# EasyEDA schematic EasyEDA export.json
TITLE: Don't wake my wife; REV: 0.1; Date: 2021-07-02; Sheet: 1/1; Drawn By: Jan Šimonek; Company: Jan Šimonek
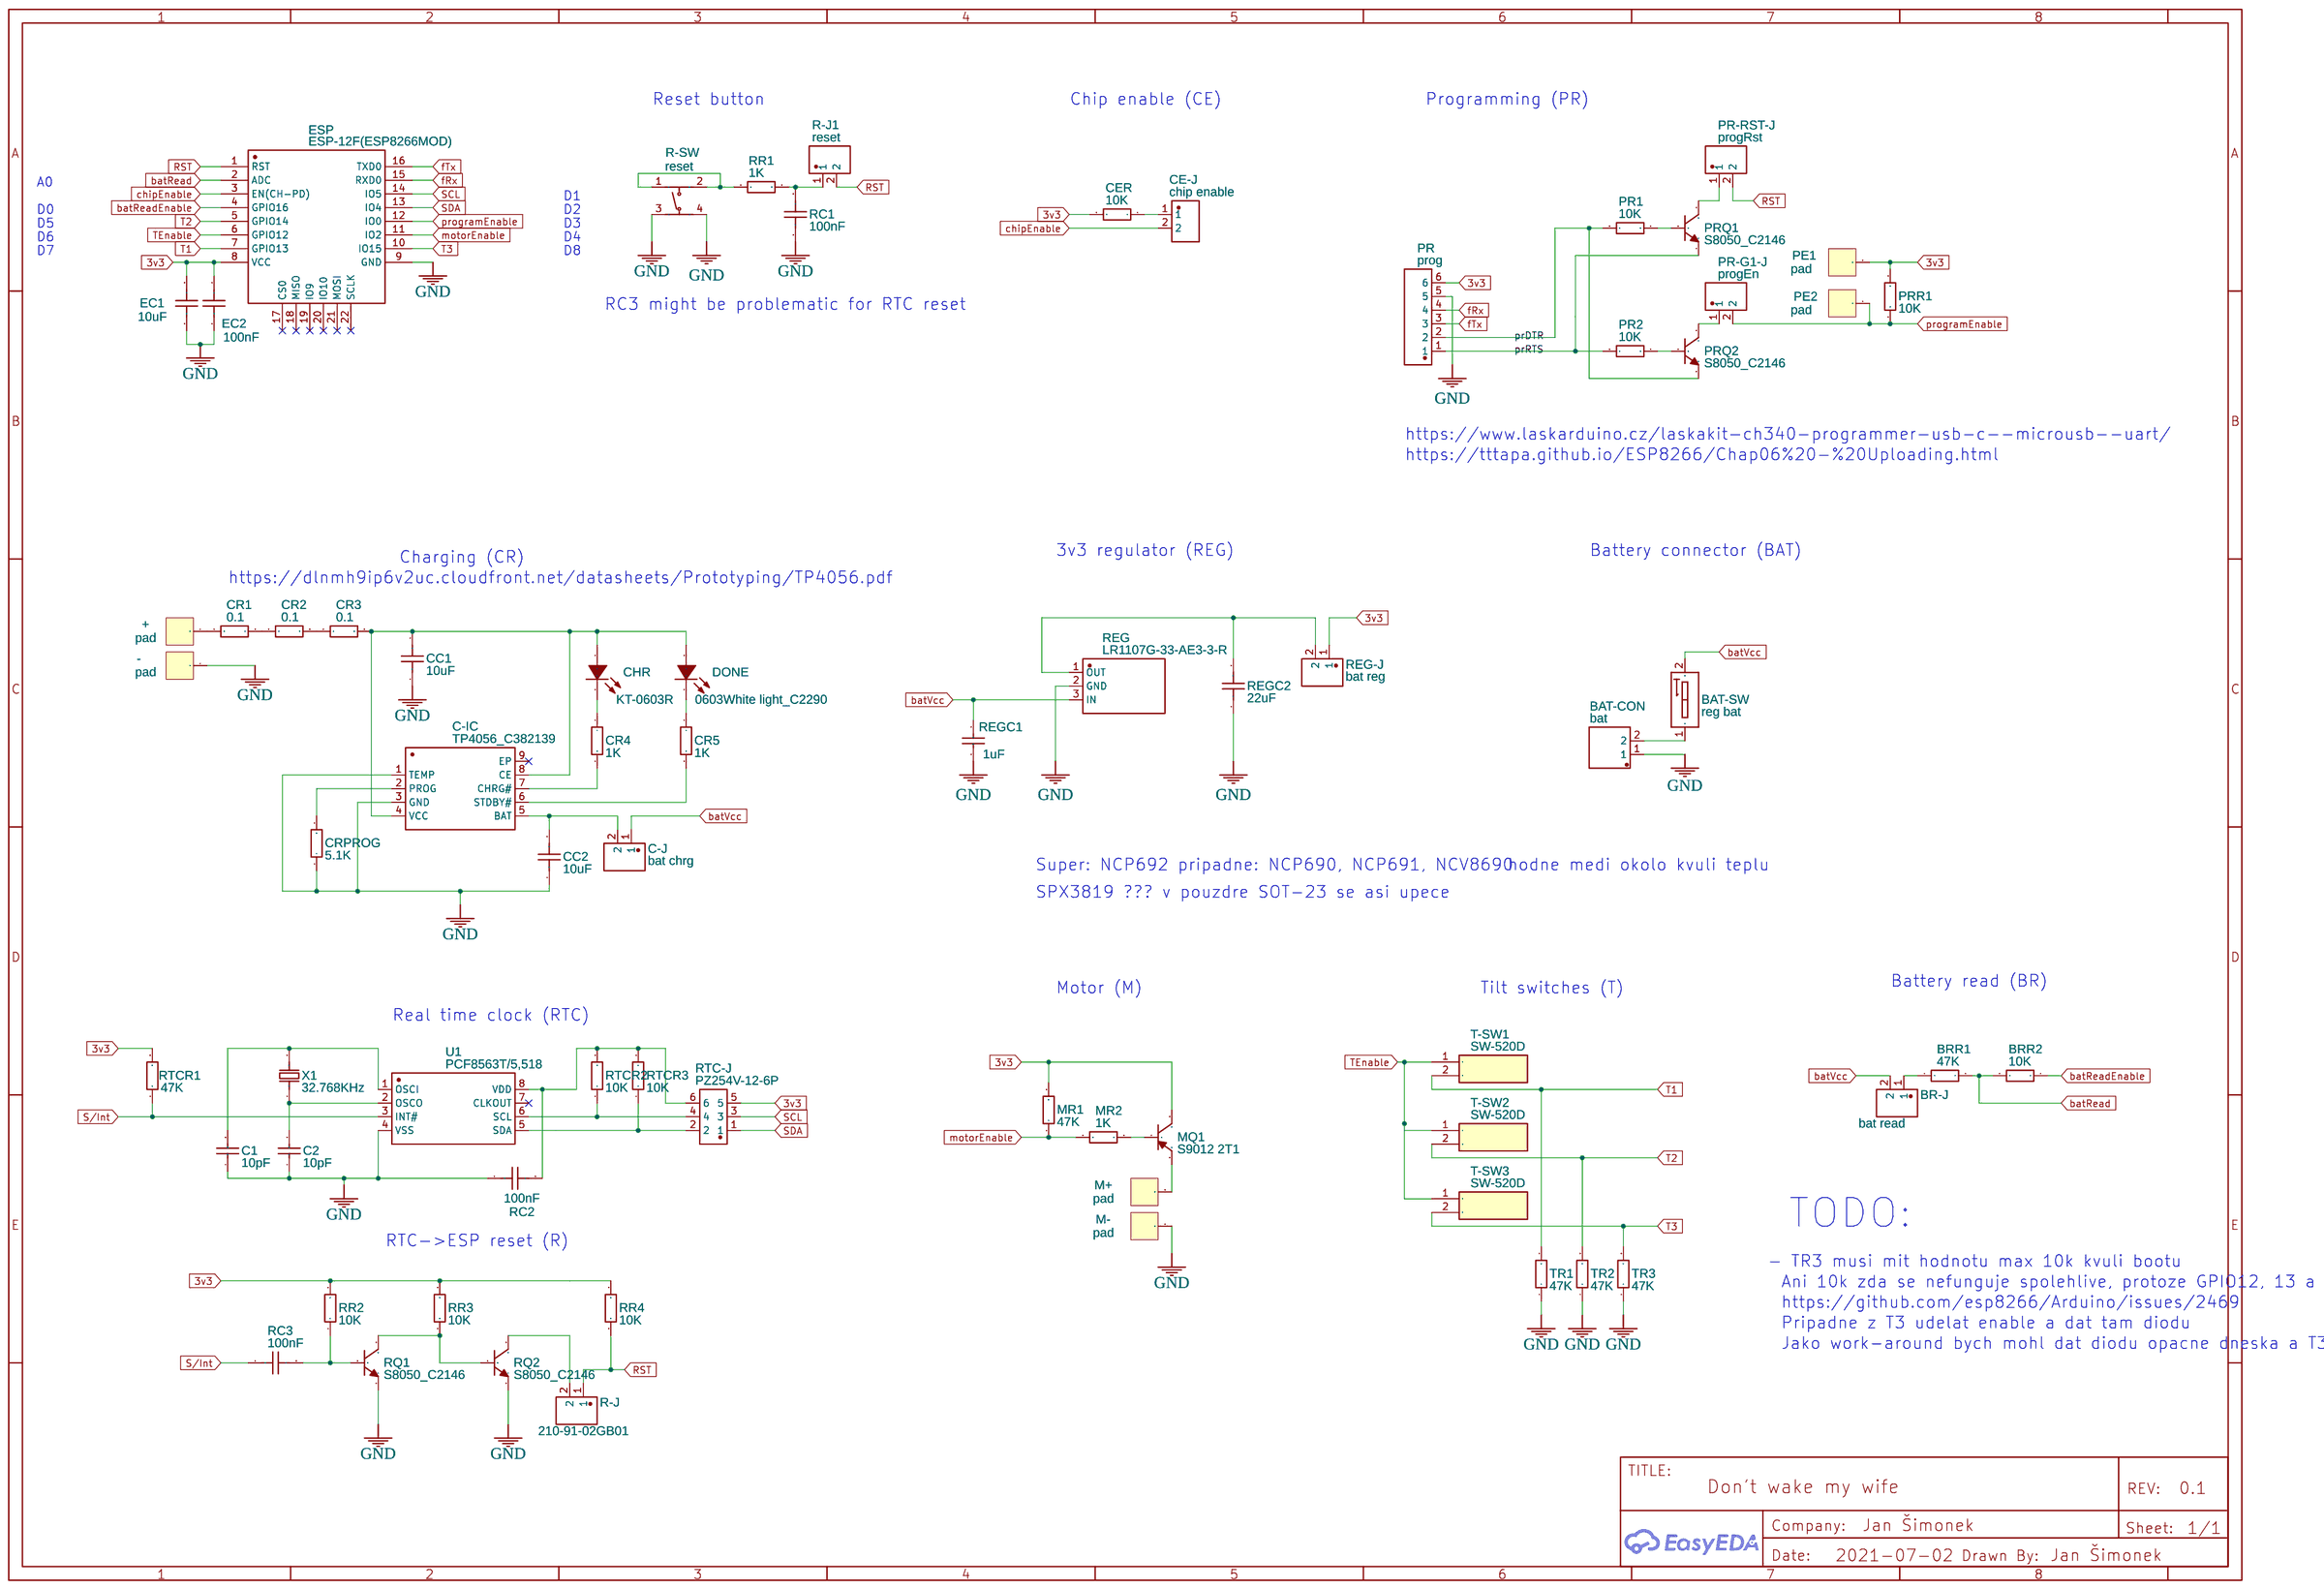
[diagram p0: schematic sheet]

## Parts
+  pad  [2.2MM PAD]
-  pad  [2.2MM PAD]
BAT-CON  bat  [CONN-TH_S2B-XH-A-LF-SN]
BAT-SW  reg bat  [SW-SMD_DSIC01LSGET]
BR-J  bat read  [HDR-TH_2P-P2.54-V-M-1]
BRR1  47K  [R0603]
BRR2  10K  [R0603]
C1  10pF  [C0603]
C2  10pF  [C0603]
C-IC  TP4056_C382139  [ESOP-8_L4.9-W3.9-P1.27-LS6.0-BL-EP]
C-J  bat chrg  [HDR-TH_2P-P2.54-V-M-1]
CC1  10uF  [C0603]
CC2  10uF  [C0603]
CE-J  chip enable  [HDR-TH_2P-P2.54-V-M-1]
CER  10K  [R0603]
CHR  KT-0603R  [LED0603-R-RD]
CR1  0.1  [R0603]
CR2  0.1  [R0603]
CR3  0.1  [R0603]
CR4  1K  [R0603]
CR5  1K  [R0603]
CRPROG  5.1K  [R0603]
DONE  0603White light_C2290  [LED0603-R-RD]
EC1  10uF  [C0603]
EC2  100nF  [C0603]
ESP  ESP-12F(ESP8266MOD)  [WIFIM-SMD_ESP-12F-ESP8266MOD]
M+  pad  [2.2MM PAD]
M-  pad  [2.2MM PAD]
MQ1  S9012 2T1  [SOT-23-3_L2.9-W1.3-P1.90-LS2.4-BR]
MR1  47K  [R0603]
MR2  1K  [R0603]
PE1  pad  [2.2MM PAD]
PE2  pad  [2.2MM PAD]
PR  prog  [HDR-TH_6P-P2.54-V-F]
PR1  10K  [R0603]
PR2  10K  [R0603]
PR-G1-J  progEn  [HDR-TH_2P-P2.54-V-M-1]
PR-RST-J  progRst  [HDR-TH_2P-P2.54-V-M-1]
PRQ1  S8050_C2146  [SOT-23-3_L3.0-W1.7-P0.95-LS2.9-BR]
PRQ2  S8050_C2146  [SOT-23-3_L3.0-W1.7-P0.95-LS2.9-BR]
PRR1  10K  [R0603]
R-J  210-91-02GB01  [HDR-TH_2P-P2.54-V-M-1]
R-J1  reset  [HDR-TH_2P-P2.54-V-M-1]
R-SW  reset  [SW-SMD_4P-L4.5-W4.5-P3.00-LS7.0]
RC1  100nF  [C0603]
RC2  100nF  [C0603]
RC3  100nF  [C0603]
REG  LR1107G-33-AE3-3-R  [SOT-23-3_L3.0-W1.7-P0.95-LS2.9-BR]
REG-J  bat reg  [HDR-TH_2P-P2.54-V-M-1]
REGC1  1uF  [C0603]
REGC2  22uF  [C0603]
RQ1  S8050_C2146  [SOT-23-3_L3.0-W1.7-P0.95-LS2.9-BR]
RQ2  S8050_C2146  [SOT-23-3_L3.0-W1.7-P0.95-LS2.9-BR]
RR1  1K  [R0603]
RR2  10K  [R0603]
RR3  10K  [R0603]
RR4  10K  [R0603]
RTC-J  PZ254V-12-6P  [HDR-TH_6P-P2.54-V-M-R2-C3-S2.54]
RTCR1  47K  [R0603]
RTCR2  10K  [R0603]
RTCR3  10K  [R0603]
T-SW1  SW-520D  [SW520D_VER]
T-SW2  SW-520D  [SW520D_VER]
T-SW3  SW-520D  [SW520D_VER]
TR1  47K  [R0603]
TR2  47K  [R0603]
TR3  47K  [R0603]
U1  PCF8563T/5,518  [SOIC-8_L5.0-W4.0-P1.27-LS6.0-BL]
X1  32.768KHz  [FC-135R_L3.2-W1.5]

## Library data of the parts
+ - M+ M- PE1 PE2 = pad: Contributor: manailadorin
BAT-CON = S2B-XH-A-(LF)(SN): Supplier: LCSC; Supplier Part: C157931; Manufacturer: JST Sales America; Contributor: LCSC; JLCPCB Part Class: Extended Part
BAT-SW = DSIC01LSGET: Supplier: LCSC; Manufacturer: KE; Supplier Part: C54948; JLCPCB Part Class: Extended Part
BR-J C-J CE-J PR-G1-J PR-RST-J R-J R-J1 REG-J = 210-91-02GB01: Supplier: LCSC; Supplier Part: C390678; Manufacturer: PINREX; Contributor: LCSC; JLCPCB Part Class: Extended Part
BRR1 MR1 RTCR1 TR1-TR3 = 0603WAF4702T5E: Supplier: LCSC; Manufacturer: UniOhm; Supplier Part: C25819; JLCPCB Part Class: Basic Part
BRR2 CER PR1 PR2 PRR1 RR2-RR4 RTCR2 RTCR3 = 0603WAF1002T5E: Supplier: LCSC; Manufacturer: UniOhm; Supplier Part: C25804; JLCPCB Part Class: Basic Part
C1 C2 = CL10C100JB8NNNC: Supplier: LCSC; Manufacturer: SAMSUNG; Supplier Part: C1634; JLCPCB Part Class: Basic Part
C-IC = TP4056_C382139: Supplier: LCSC; Supplier Part: C382139; Manufacturer: TPOWER; Manufacturer Part: TP4056; Contributor: LCSC; JLCPCB Part Class: Extended Part
CC1 CC2 EC1 = CL10A106KP8NNNC: Supplier: LCSC; Manufacturer: SAMSUNG; Supplier Part: C19702; JLCPCB Part Class: Basic Part
CHR = KT-0603R: Supplier: LCSC; Manufacturer: KENTO; Supplier Part: C2286; JLCPCB Part Class: Basic Part
CR1-CR3 = 0603WAJ010KT5E: Supplier: LCSC; Supplier Part: C247025; Manufacturer: Uniroyal Elec; Contributor: LCSC; JLCPCB Part Class: Extended Part
CR4 CR5 MR2 RR1 = 0603WAF1001T5E: Supplier: LCSC; Manufacturer: UniOhm; Supplier Part: C21190; JLCPCB Part Class: Basic Part
CRPROG = 0603WAF5101T5E: Supplier: LCSC; Manufacturer: UniOhm; Supplier Part: C23186; JLCPCB Part Class: Basic Part
DONE = 0603White light_C2290: Supplier: LCSC; Manufacturer: KENTO; Manufacturer Part: 0603White light; Supplier Part: C2290; JLCPCB Part Class: Basic Part
EC2 RC1-RC3 = CC0603KRX7R9BB104: Supplier: LCSC; Manufacturer: YAGEO; Supplier Part: C14663; JLCPCB Part Class: Basic Part
ESP = ESP-12F(ESP8266MOD): Supplier: LCSC; Manufacturer: Ai-Thinker; Supplier Part: C82891; JLCPCB Part Class: Extended Part
MQ1 = S9012 2T1: Supplier: LCSC; Manufacturer: CJ; Supplier Part: C8543; JLCPCB Part Class: Basic Part
PR = Header-Female-2.54_1x6: Supplier: LCSC; Manufacturer: BOOMELE; Manufacturer Part: Female header 1*6p; Supplier Part: C40877; JLCPCB Part Class: Extended Part
PRQ1 PRQ2 RQ1 RQ2 = S8050_C2146: Supplier: LCSC; Manufacturer: CJ; Manufacturer Part: S8050; Supplier Part: C2146; JLCPCB Part Class: Basic Part
R-SW = UK-B0206-G5-160-JZ: Supplier: LCSC; Supplier Part: C620330; Manufacturer: USAKRO; Contributor: LCSC
REG = LR1107G-33-AE3-3-R: Supplier: LCSC; Manufacturer: UTC; Contributor: LCSC; Supplier Part: C171497; JLCPCB Part Class: Extended Part
REGC1 = CL10A105KB8NNNC: Supplier: LCSC; Manufacturer: SAMSUNG; Supplier Part: C15849; JLCPCB Part Class: Basic Part
REGC2 = CL10A226MQ8NRNC: Supplier: LCSC; Manufacturer: SAMSUNG; Supplier Part: C59461; JLCPCB Part Class: Basic Part
RTC-J = PZ254V-12-6P: Supplier: LCSC; Supplier Part: C492420; Manufacturer: XFCN; Contributor: LCSC; JLCPCB Part Class: Extended Part
T-SW1-T-SW3 = SW-520D: Contributor: adrirobot
U1 = PCF8563T/5,518: Supplier: LCSC; Manufacturer: NXP; Supplier Part: C7440; JLCPCB Part Class: Basic Part
X1 = Q13FC1350000400: Supplier: LCSC; Manufacturer: EPSON; Supplier Part: C32346; JLCPCB Part Class: Basic Part

## Nets
3v3: CER.2 EC1.2 EC2.2 ESP.8(VCC) MQ1.3(C) MR1.2 PE1.1 PR.6 PRR1.2 REG-J.1 RR2.2 RR3.2 RR4.2 RTC-J.5 RTCR1.2
GND: -.1 BAT-CON.1 C1.1 C2.1 C-IC.1(TEMP) C-IC.3(GND) CC1.1 CC2.1 CRPROG.1 EC1.1 EC2.1 ESP.9(GND) M-.1 PR.5 R-SW.3 R-SW.4 RC1.1 RC2.1 REG.2(GND) REGC1.1 REGC2.1 RQ1.2(E) RQ2.2(E) TR1.1 TR2.1 TR3.1 U1.4(VSS)
batRead: BRR1.2 BRR2.2 ESP.2(ADC)
batReadEnable: BRR2.1 ESP.4(GPIO16)
batVcc: BAT-SW.2(A2) BR-J.2 C-J.1 REG.3(IN) REGC1.2
chipEnable: CE-J.2 ESP.3(EN(CH-PD))
fRx: ESP.15(RXD0) PR.4
fTx: ESP.16(TXD0) PR.3
motorEnable: ESP.11(IO2) MR1.1 MR2.1
prDTR: PR.2 PR1.2 PRQ2.2(E)
programEnable: ESP.12(IO0) PE2.1 PR-G1-J.2 PRR1.1
prRTS: PR.1 PR2.2 PRQ1.2(E)
RST: ESP.1(RST) PR-RST-J.2 R-J.1 R-J1.2 RR4.1
S/Int: RC3.1 RTCR1.1 U1.3(INT#)
SCL: ESP.14(IO5) RTC-J.3
SDA: ESP.13(IO4) RTC-J.1
T1: ESP.7(GPIO13) T-SW1.2 TR1.2
T2: ESP.5(GPIO14) T-SW2.2 TR2.2
T3: ESP.10(IO15) T-SW3.2 TR3.2
TEnable: ESP.6(GPIO12) T-SW1.1 T-SW2.1 T-SW3.1
Net-(+-1): +.1 CR1.1
Net-(BAT-CON-2): BAT-CON.2 BAT-SW.1(A1)
Net-(BR-J-1): BR-J.1 BRR1.1
Net-(C1-2): C1.2 U1.1(OSCI) X1.2
Net-(C2-2): C2.2 U1.2(OSCO) X1.1
Net-(C-IC-2): C-IC.2(PROG) CRPROG.2
Net-(C-IC-4): C-IC.4(VCC) C-IC.8(CE) CC1.2 CHR.1(A) CR3.2 DONE.1(A)
Net-(C-IC-5): C-IC.5(BAT) C-J.2 CC2.2
Net-(C-IC-6): C-IC.6(STDBY#) CR5.2
Net-(C-IC-7): C-IC.7(CHRG#) CR4.2
Net-(CE-J-1): CE-J.1 CER.1
Net-(CHR-2): CHR.2(K) CR4.1
Net-(CR1-2): CR1.2 CR2.1
Net-(CR2-2): CR2.2 CR3.1
Net-(CR5-1): CR5.1 DONE.2(K)
Net-(M+-1): M+.1 MQ1.2(E)
Net-(MQ1-1): MQ1.1(B) MR2.2
Net-(PR1-1): PR1.1 PRQ1.1(B)
Net-(PR2-1): PR2.1 PRQ2.1(B)
Net-(PR-G1-J-1): PR-G1-J.1 PRQ2.3(C)
Net-(PR-RST-J-1): PR-RST-J.1 PRQ1.3(C)
Net-(R-J1-1): R-J1.1 RC1.2 RR1.2
Net-(R-J-2): R-J.2 RQ2.3(C)
Net-(R-SW-1): R-SW.1 R-SW.2 RR1.1
Net-(RC2-2): RC2.2 RTC-J.6 RTCR2.2 RTCR3.2 U1.8(VDD)
Net-(RC3-2): RC3.2 RQ1.1(B) RR2.1
Net-(REG-1): REG.1(OUT) REG-J.2 REGC2.2
Net-(RQ1-3): RQ1.3(C) RQ2.1(B) RR3.1
Net-(RTC-J-2): RTC-J.2 RTCR3.1 U1.5(SDA)
Net-(RTC-J-4): RTC-J.4 RTCR2.1 U1.6(SCL)

Not connected (* = marked no-connect by the designer): C-IC 9(EP)*; ESP 17(CS0)* 18(MISO)* 19(IO9)* 20(IO10)* 21(MOSI)* 22(SCLK)*; U1 7(CLKOUT)*

## Notes on the sheet
- Reset button
- Chip enable (CE)
- Programming (PR)
- A0
- D1
- D0
- D2
- D5
- D3
- D6
- D4
- D7
- D8
- RC3 might be problematic for RTC reset
- https://www.laskarduino.cz/laskakit-ch340-programmer-usb-c--microusb--uart/
- https://tttapa.github.io/ESP8266/Chap06%20-%20Uploading.html
- 3v3 regulator (REG)
- Battery connector (BAT)
- Charging (CR)
- https://dlnmh9ip6v2uc.cloudfront.net/datasheets/Prototyping/TP4056.pdf
- Super: NCP692 pripadne: NCP690, NCP691, NCV8690
- hodne medi okolo kvuli teplu
- SPX3819 ??? v pouzdre SOT-23 se asi upece
- Motor (M)
- Tilt switches (T)
- Battery read (BR)
- Real time clock (RTC)
- TODO:
- RTC->ESP reset (R)
- - TR3 musi mit hodnotu max 10k kvuli bootu
- Ani 10k zda se nefunguje spolehlive, protoze GPIO12, 13 a 14 maji v prubehu spanku slaby high
- https://github.com/esp8266/Arduino/issues/2469
- Pripadne z T3 udelat enable a dat tam diodu
- Jako work-around bych mohl dat diodu opacne dneska a T3 vycitat tak ze na T3 dam 1 a snimat budu v TEnable
